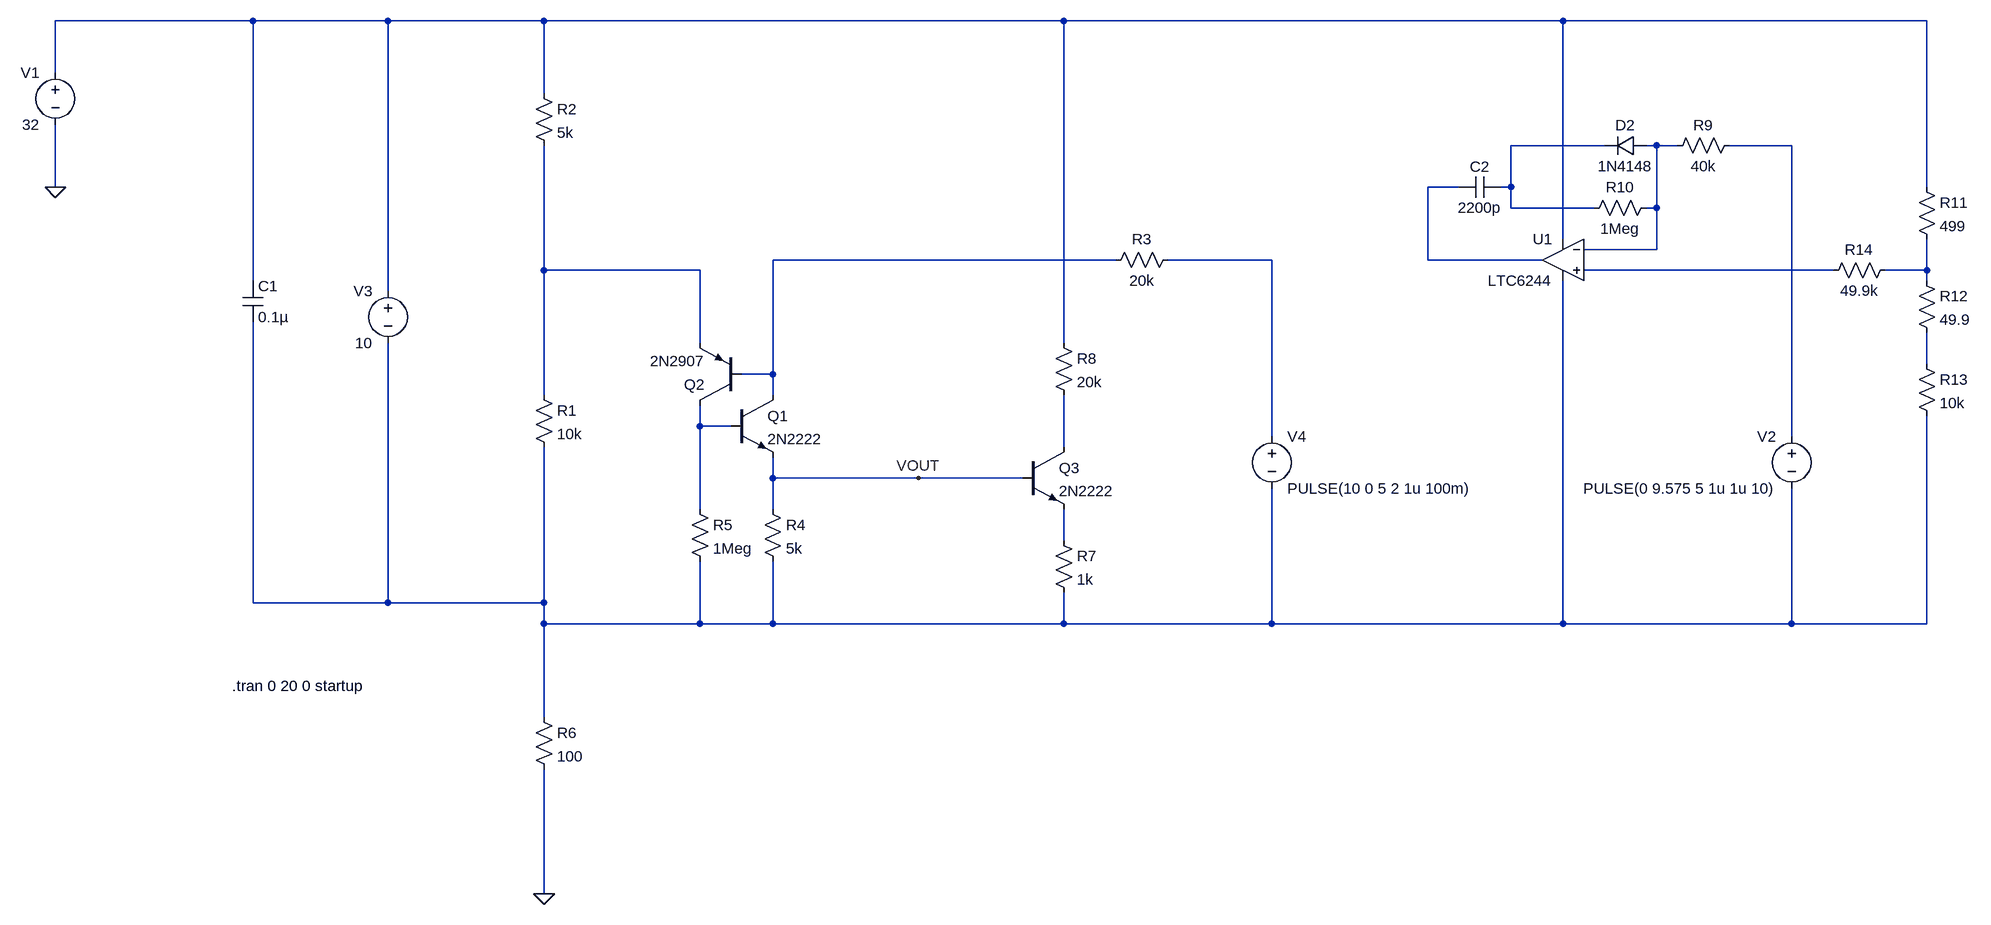
[diagram p0: schematic Floating_SCR_Latch.asc]
Floating_SCR_Latch.asc, the LTspice schematic file:
Version 4
SHEET 1 2108 1108
WIRE -544 -480 -848 -480
WIRE -336 -480 -544 -480
WIRE -96 -480 -336 -480
WIRE 704 -480 -96 -480
WIRE 1472 -480 704 -480
WIRE 2032 -480 1472 -480
WIRE -848 -400 -848 -480
WIRE -96 -368 -96 -480
WIRE 1536 -288 1392 -288
WIRE 1616 -288 1600 -288
WIRE 1648 -288 1616 -288
WIRE 1824 -288 1728 -288
WIRE -848 -224 -848 -320
WIRE 1312 -224 1264 -224
WIRE 1392 -224 1392 -288
WIRE 1392 -224 1376 -224
WIRE 2032 -224 2032 -480
WIRE 1392 -192 1392 -224
WIRE 1520 -192 1392 -192
WIRE 1616 -192 1616 -288
WIRE 1616 -192 1600 -192
WIRE 1472 -144 1472 -480
WIRE 1616 -128 1616 -192
WIRE 1616 -128 1504 -128
WIRE 784 -112 256 -112
WIRE 1024 -112 864 -112
WIRE 1264 -112 1264 -224
WIRE 1440 -112 1264 -112
WIRE -96 -96 -96 -288
WIRE 144 -96 -96 -96
WIRE 1888 -96 1504 -96
WIRE 2032 -96 2032 -144
WIRE 2032 -96 1968 -96
WIRE -544 -80 -544 -480
WIRE 2032 -80 2032 -96
WIRE -336 -64 -336 -480
WIRE 144 16 144 -96
WIRE 704 16 704 -480
WIRE 2032 48 2032 0
WIRE 256 64 256 -112
WIRE 256 64 208 64
WIRE -96 96 -96 -96
WIRE 256 96 256 64
WIRE 144 144 144 112
WIRE 192 144 144 144
WIRE 1024 160 1024 -112
WIRE 1824 160 1824 -288
WIRE 704 176 704 96
WIRE 256 224 256 192
WIRE 480 224 256 224
WIRE 640 224 480 224
WIRE 144 272 144 144
WIRE 256 272 256 224
WIRE 704 320 704 272
WIRE -544 416 -544 -16
WIRE -336 416 -336 16
WIRE -336 416 -544 416
WIRE -96 416 -96 176
WIRE -96 416 -336 416
WIRE -96 448 -96 416
WIRE 144 448 144 352
WIRE 144 448 -96 448
WIRE 256 448 256 352
WIRE 256 448 144 448
WIRE 704 448 704 400
WIRE 704 448 256 448
WIRE 1024 448 1024 240
WIRE 1024 448 704 448
WIRE 1472 448 1472 -80
WIRE 1472 448 1024 448
WIRE 1824 448 1824 240
WIRE 1824 448 1472 448
WIRE 2032 448 2032 128
WIRE 2032 448 1824 448
WIRE -96 592 -96 448
WIRE -96 864 -96 672
FLAG -848 -224 0
FLAG 480 224 VOUT
FLAG -96 864 0
SYMBOL npn 192 96 R0
SYMATTR InstName Q1
SYMATTR Value 2N2222
SYMBOL pnp 208 112 R180
SYMATTR InstName Q2
SYMATTR Value 2N2907
SYMBOL res -112 80 R0
SYMATTR InstName R1
SYMATTR Value 10k
SYMBOL res -112 -384 R0
SYMATTR InstName R2
SYMATTR Value 5k
SYMBOL res 880 -128 R90
WINDOW 0 0 56 VBottom 2
WINDOW 3 32 56 VTop 2
SYMATTR InstName R3
SYMATTR Value 20k
SYMBOL res 240 256 R0
SYMATTR InstName R4
SYMATTR Value 5k
SYMBOL voltage -848 -416 M0
WINDOW 123 0 0 Left 0
WINDOW 39 0 0 Left 0
SYMATTR InstName V1
SYMATTR Value 32
SYMBOL voltage 1824 144 M0
WINDOW 123 0 0 Left 0
WINDOW 39 0 0 Left 0
SYMATTR InstName V2
SYMATTR Value PULSE(0 9.575 5 1u 1u 10)
SYMBOL res 128 256 R0
SYMATTR InstName R5
SYMATTR Value 1Meg
SYMBOL res -112 576 R0
SYMATTR InstName R6
SYMATTR Value 100
SYMBOL npn 640 176 R0
SYMATTR InstName Q3
SYMATTR Value 2N2222
SYMBOL res 688 304 R0
SYMATTR InstName R7
SYMATTR Value 1k
SYMBOL res 688 0 R0
SYMATTR InstName R8
SYMATTR Value 20k
SYMBOL cap -560 -80 R0
SYMATTR InstName C1
SYMATTR Value 0.1µ
SYMBOL res 1744 -304 R90
WINDOW 0 0 56 VBottom 2
WINDOW 3 32 56 VTop 2
SYMATTR InstName R9
SYMATTR Value 40k
SYMBOL cap 1376 -240 R90
WINDOW 0 0 32 VBottom 2
WINDOW 3 32 32 VTop 2
SYMATTR InstName C2
SYMATTR Value 2200p
SYMBOL diode 1600 -304 R90
WINDOW 0 0 32 VBottom 2
WINDOW 3 32 32 VTop 2
SYMATTR InstName D2
SYMATTR Value 1N4148
SYMBOL res 1616 -208 R90
WINDOW 0 0 56 VBottom 2
WINDOW 3 32 56 VTop 2
SYMATTR InstName R10
SYMATTR Value 1Meg
SYMBOL res 2016 -240 R0
SYMATTR InstName R11
SYMATTR Value 499
SYMBOL res 2016 -96 R0
SYMATTR InstName R12
SYMATTR Value 49.9
SYMBOL res 2016 32 R0
SYMATTR InstName R13
SYMATTR Value 10k
SYMBOL voltage -336 -80 M0
WINDOW 123 0 0 Left 0
WINDOW 39 0 0 Left 0
SYMATTR InstName V3
SYMATTR Value 10
SYMBOL res 1984 -112 R90
WINDOW 0 0 56 VBottom 2
WINDOW 3 32 56 VTop 2
SYMATTR InstName R14
SYMATTR Value 49.9k
SYMBOL OpAmps\\LTC6244 1472 -112 M0
SYMATTR InstName U1
SYMBOL voltage 1024 144 R0
WINDOW 123 0 0 Left 0
WINDOW 39 0 0 Left 0
SYMATTR InstName V4
SYMATTR Value PULSE(10 0 5 2 1u 100m)
TEXT -576 544 Left 2 !.tran 0 20 0 startup

The netlist it stands for:
* Floating_SCR_Latch.asc
Q1 N006 N012 VOUT 0 2N2222
Q2 N012 N006 N008 0 2N2907
R1 N008 N015 10k
R2 N001 N008 5k
R3 N007 N006 20k
R4 VOUT N015 5k
V1 N001 0 32
V2 N004 N015 PULSE(0 9.575 5 1u 1u 10)
R5 N012 N015 1Meg
R6 N015 0 100
Q3 N013 VOUT N014 0 2N2222
R7 N014 N015 1k
R8 N001 N013 20k
C1 N001 N015 0.1µ
R9 N004 N003 40k
C2 N002 N005 2200p
D2 N003 N002 1N4148
R10 N003 N002 1Meg
R11 N001 N010 499
R12 N010 N011 49.9
R13 N011 N015 10k
V3 N001 N015 10
R14 N010 N009 49.9k
XU1 N009 N003 N001 N015 N005 LTC6244  ; pins In+ In- V+ V- OUT
V4 N007 N015 PULSE(10 0 5 2 1u 100m)
.model D D
.lib standard.dio
.model NPN NPN
.model PNP PNP
.lib standard.bjt
.tran 0 20 0 startup
.backanno
.end